# EasyEDA schematic SCH_STAYAW_0.3_2024-05-22.json
TITLE: Sheet_1; REV: 1.0; Date: 2024-05-15; Sheet: 1/1; Drawn By: forcontact.we; Company: Your Company
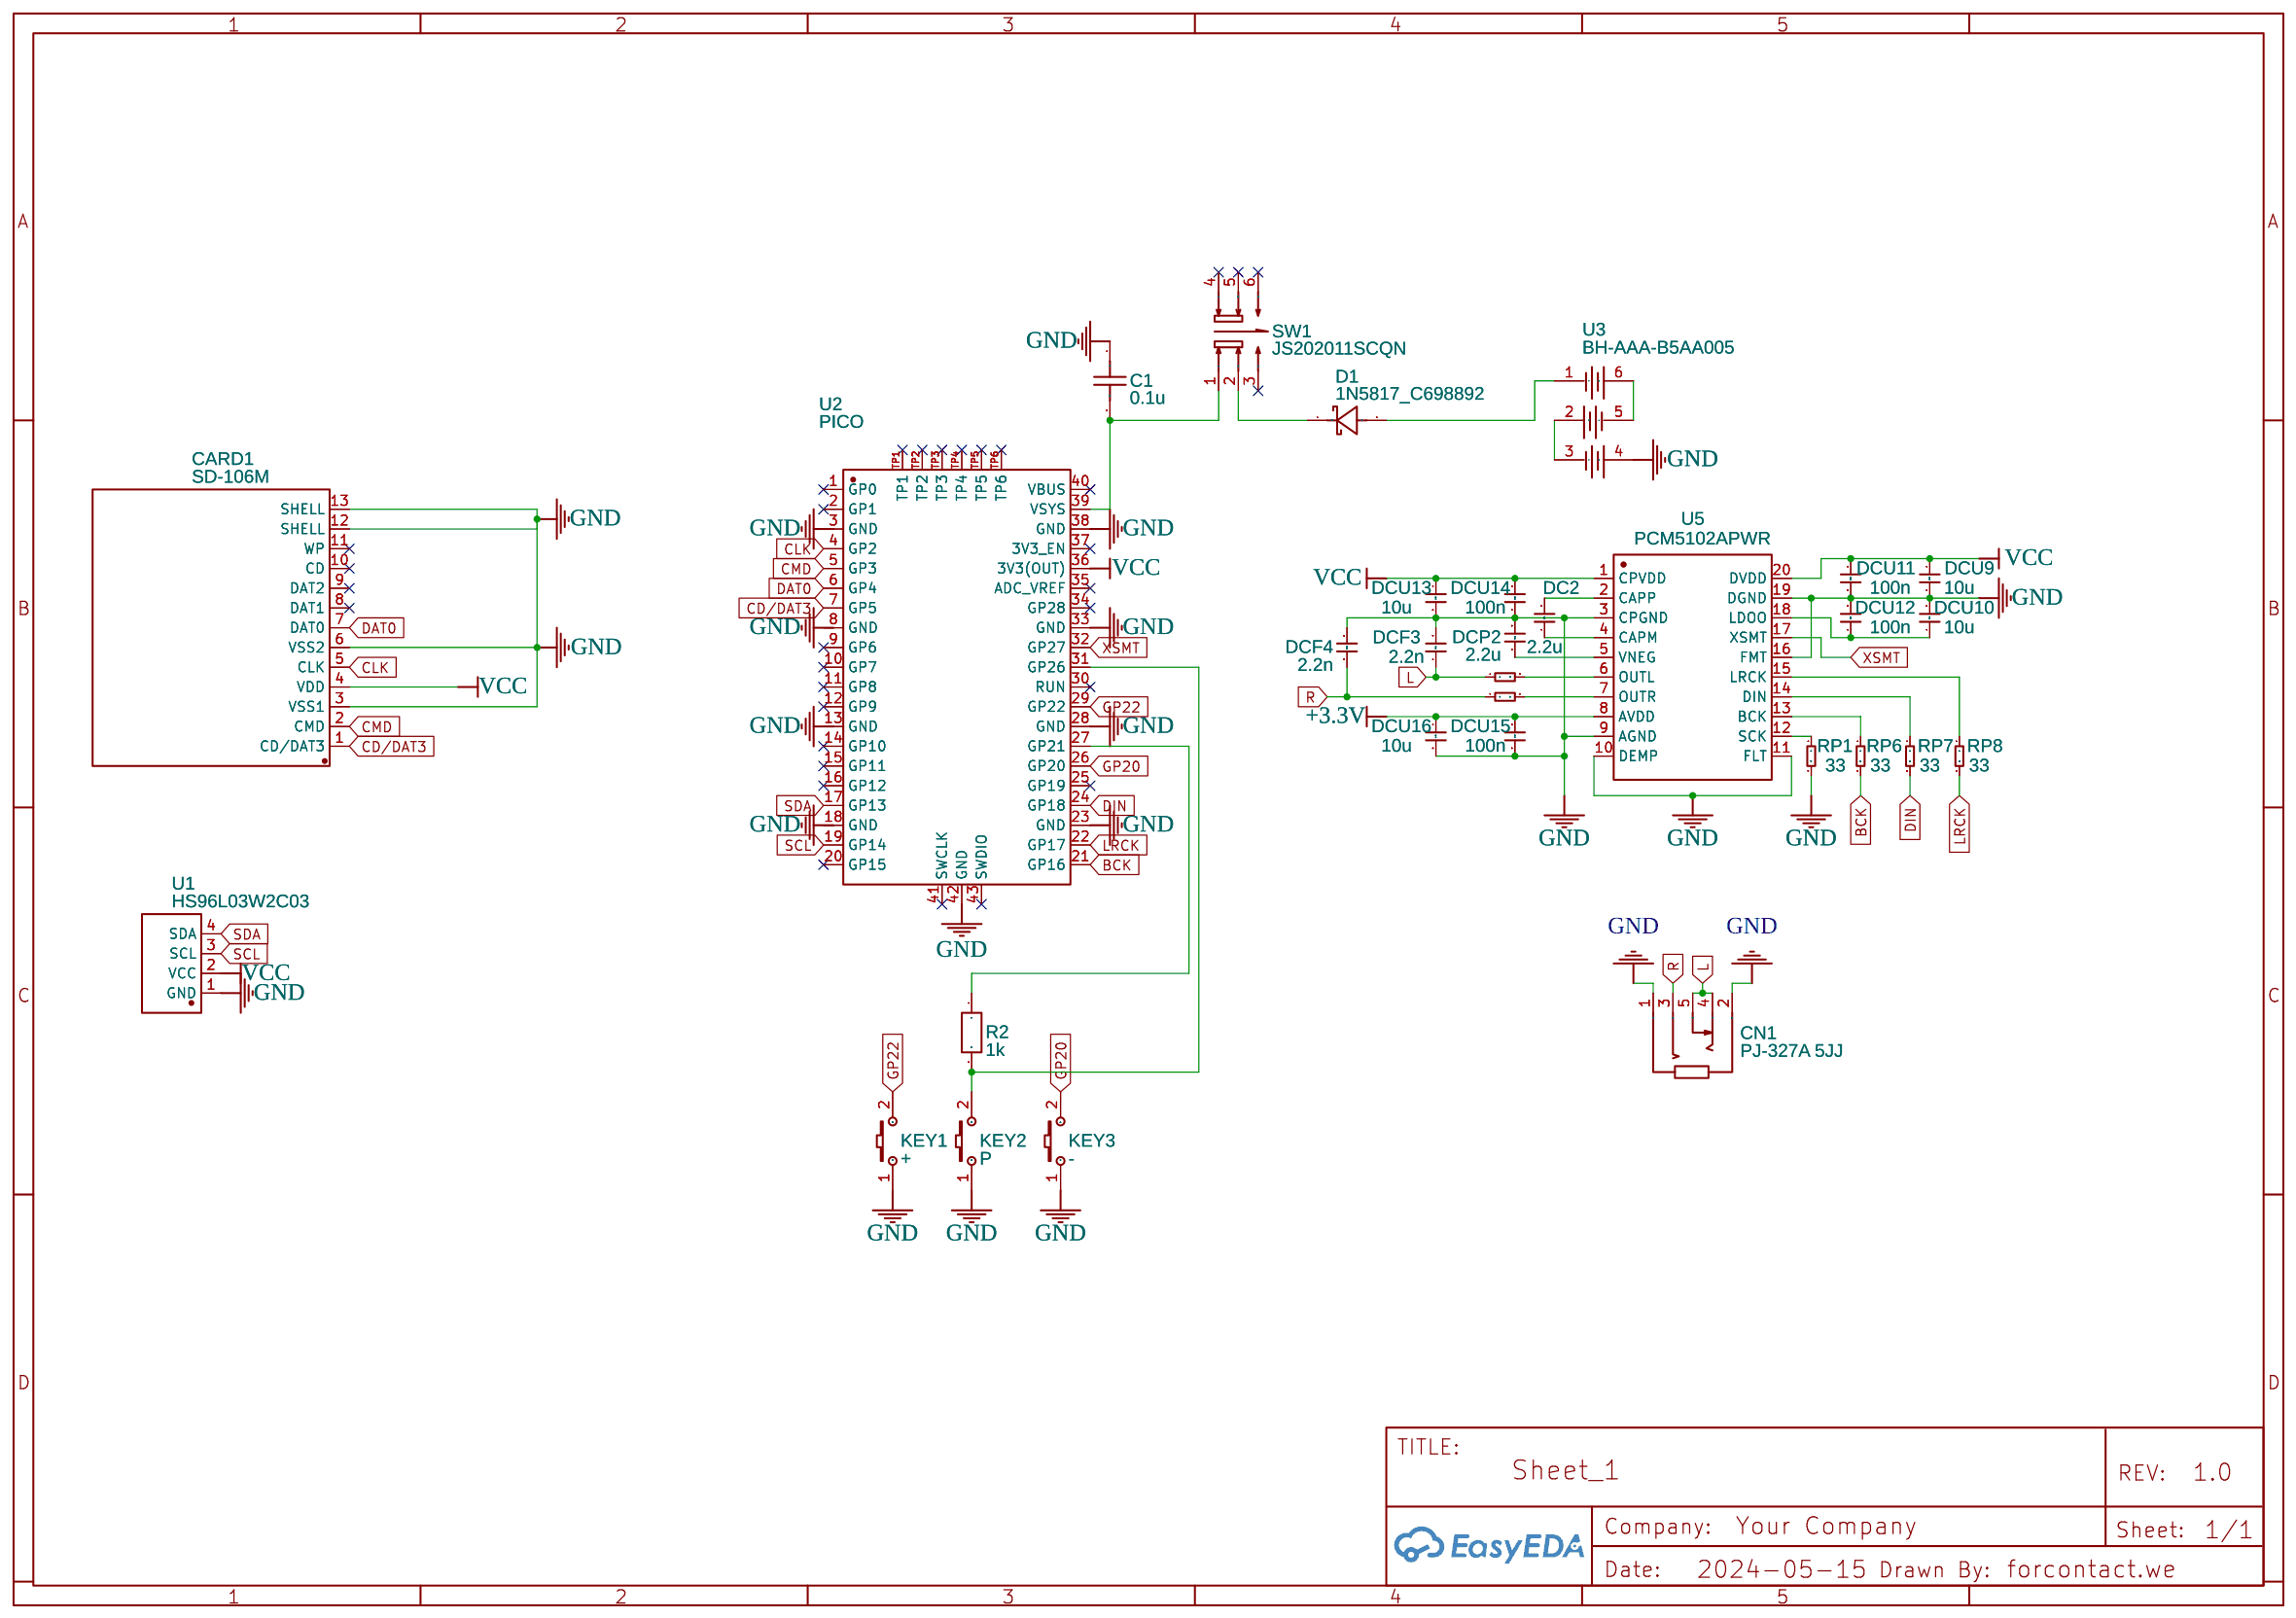
[diagram p0: schematic sheet]

## Parts
C1  0.1u  [C0603]
CARD1  SD-106M  [SD-SMD_SD-106M]
CN1  PJ-327A 5JJ  [AUDIO-SMD_PJ-327A5JJ]
D1  1N5817_C698892  [DO-41_BD2.4-L4.7-P8.70-D0.9-RD]
DC2  2.2u  [C0805]
DCF3  2.2n  [C0805]
DCF4  2.2n  [C0805]
DCP2  2.2u  [C0805]
DCU9  10u  [C0805]
DCU10  10u  [C0805]
DCU11  100n  [C0805]
DCU12  100n  [C0805]
DCU13  10u  [C0805]
DCU14  100n  [C0805]
DCU15  100n  [C0805]
DCU16  10u  [C0805]
DR3  470  [R0603]
DR4  470  [R0603]
KEY1  +  [KEY-SMD_2P-L6.2-W3.6-LS8.0]
KEY2  P  [KEY-SMD_2P-L6.2-W3.6-LS8.0]
KEY3  -  [KEY-SMD_2P-L6.2-W3.6-LS8.0]
R2  1k  [R0603]
RP1  33  [R0603]
RP6  33  [R0603]
RP7  33  [R0603]
RP8  33  [R0603]
SW1  JS202011SCQN  [SW-SMD_JS202011SCQN]
U1  HS96L03W2C03  [OLED-TH_L27.8-W27.2-P2.54_C9900033791]
U2  PICO  [COMM-SMD_L51.0-W21.0-P2.54_SC0916]
U3  BH-AAA-B5AA005  [BAT-SMD_BH-AAA-B5AA005]
U5  PCM5102APWR  [TSSOP-20_L6.5-W4.4-P0.65-LS6.4-BL]

## Library data of the parts
C1 = C_0603_US: Contributor: LCEDA_Lib
CARD1 = SD-106M: Contributor: LCSC; Supplier: LCSC; Supplier Part: C266603; Manufacturer: XUNPU(讯普); JLCPCB Part Class: Extended Part
CN1 = PJ-327A 5JJ: Contributor: LCSC; Supplier: LCSC; Supplier Part: C668605; Manufacturer: SHOU HAN(首韩); JLCPCB Part Class: Extended Part
D1 = 1N5817_C698892: Contributor: LCSC; Supplier: LCSC; Supplier Part: C698892; Manufacturer: YANGJIE(扬杰); Manufacturer Part: 1N5817; JLCPCB Part Class: Extended Part
DC2 DCP2 = Cap_0603_US: Supplier: LCSC; Contributor: fgfgfg0923; Manufacturer Part: CL21B105KBFNNNE; Manufacturer: SAMSUNG; Supplier Part: C28323
DCF3 DCF4 DCU9-DCU16 = Cap_0603_US: Supplier: LCSC; Contributor: fgfgfg0923; Manufacturer Part: CL21A106KAYNNNE; Manufacturer: SAMSUNG; Supplier Part: C15850
DR3 DR4 RP1 RP6-RP8 = Res_0603(1/10W)_EU: Contributor: fgfgfg0923; Manufacturer Part: ?
KEY1-KEY3 = K2-3.6×6.1_SMD: Supplier Part: C118141; Supplier: LCSC; Manufacturer Part: K2-1107ST-A4SW-06; Contributor: LCEDA_Lib; 制造商: 韩国韩荣
R2 = R_0603_EU: Contributor: LCEDA_Lib
SW1 = JS202011SCQN: Contributor: LCSC; Supplier: LCSC; Supplier Part: C221666; Manufacturer: C&K; JLCPCB Part Class: Extended Part; link: https://lcsc.com/eda_search?q=C221666&%26type=1&ref=editor
U1 = HS96L03W2C03: Contributor: lcsc; Supplier: LCSC; Supplier Part: C5248080; Manufacturer: HS(汉昇); JLCPCB Part Class: Extended Part
U2 = PICO: Supplier: LCSC; Supplier Part: C7203002; Manufacturer: Raspberry Pi(树莓派); JLCPCB Part Class: Extended Part; Contributor: lcsc
U3 = BH-AAA-B5AA005: Contributor: lcsc; Supplier: LCSC; Supplier Part: C2979170; Manufacturer: MYOUNG(美阳); JLCPCB Part Class: Extended Part
U5 = PCM5102APWR: Supplier: LCSC; Manufacturer: TI; Contributor: LCSC; Supplier Part: C107671; SMT Type: Extend; JLCPCB SMD: Yes; LCSC Assembly: Yes

## Nets
+3.3V: DCU15.1 DCU16.1 U5.8(AVDD)
GND: C1.1 CARD1.3(VSS1) CARD1.6(VSS2) CARD1.12(SHELL) CARD1.13(SHELL) CN1.1 CN1.2 DCF3.2 DCF4.2 DCP2.2 DCU9.1 DCU10.2 DCU11.1 DCU12.2 DCU13.2 DCU14.2 DCU15.2 DCU16.2 KEY1.1 KEY2.1 KEY3.1 RP1.2 U1.1(GND) U2.3(GND) U2.8(GND) U2.13(GND) U2.18(GND) U2.23(GND) U2.28(GND) U2.33(GND) U2.38(GND) U2.42(GND) U3.4(+) U5.3(CPGND) U5.9(AGND) U5.10(DEMP) U5.11(FLT) U5.16(FMT) U5.19(DGND)
VCC: CARD1.4(VDD) DCU9.2 DCU11.2 DCU13.1 DCU14.1 U1.2(VCC) U2.36(3V3(OUT)) U5.1(CPVDD) U5.20(DVDD)
BCK: RP6.2 U2.21(GP16)
CD/DAT3: CARD1.1(CD/DAT3) U2.7(GP5)
CLK: CARD1.5(CLK) U2.4(GP2)
CMD: CARD1.2(CMD) U2.5(GP3)
DAT0: CARD1.7(DAT0) U2.6(GP4)
DIN: RP7.2 U2.24(GP18)
GP20: KEY3.2 U2.26(GP20)
GP22: KEY1.2 U2.29(GP22)
L: CN1.4 CN1.5 DCF3.1 DR4.1
LRCK: RP8.2 U2.22(GP17)
R: CN1.3 DCF4.1 DR3.1
SCL: U1.3(SCL) U2.19(GP14)
SDA: U1.4(SDA) U2.17(GP13)
XSMT: U2.32(GP27) U5.17(XSMT)
Net-(C1-2): C1.2 SW1.1 U2.39(VSYS)
Net-(D1-1): D1.1 SW1.2
Net-(D1-2): D1.2 U3.1(-)
Net-(DC2-1): DC2.1 U5.4(CAPM)
Net-(DC2-2): DC2.2 U5.2(CAPP)
Net-(DCP2-1): DCP2.1 U5.5(VNEG)
Net-(DCU10-1): DCU10.1 DCU12.1 U5.18(LDOO)
Net-(DR3-2): DR3.2 U5.7(OUTR)
Net-(DR4-2): DR4.2 U5.6(OUTL)
Net-(KEY2-2): KEY2.2 R2.2 U2.31(GP26)
Net-(R2-1): R2.1 U2.27(GP21)
Net-(RP1-1): RP1.1 U5.12(SCK)
Net-(RP6-1): RP6.1 U5.13(BCK)
Net-(RP7-1): RP7.1 U5.14(DIN)
Net-(RP8-1): RP8.1 U5.15(LRCK)
Net-(U3-2): U3.2(+) U3.3(-)
Net-(U3-5): U3.5(-) U3.6(+)

Not connected (* = marked no-connect by the designer): CARD1 8(DAT1)* 9(DAT2)* 10(CD)* 11(WP)*; SW1 3* 4* 5* 6*; U2 1(GP0)* 2(GP1)* 9(GP6)* 10(GP7)* 11(GP8)* 12(GP9)* 14(GP10)* 15(GP11)* 16(GP12)* 20(GP15)* 25(GP19)* 30(RUN)* 34(GP28)* 35(ADC_VREF)* 37(3V3_EN)* 40(VBUS)* 41(SWCLK)* 43(SWDIO)* TP1* TP2* TP3* TP4* TP5* TP6*
